# Altium schematic sheet Connectors.SchDoc
size A
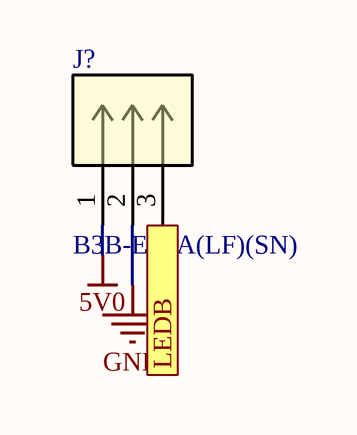
[diagram p0: Connectors.SchDoc]

## Parts
J?  B3B-EH-A(LF)(SN)  [CONN3_B3B-EH-A(LF)(SN)_JST]

## Ports
LEDB (in)

## Nets
5V0: J?.1
GND: J?.2
LEDB: J?.3 ; port LEDB

## Library data of the parts
J? = B3B-EH-A(LF)(SN): No Description Available; Vendor: JST; Built_By: EMA_Kyle; SourceLibrary: JST_2020-07-31; Datasheet: http://www.jst-mfg.com/product/pdf/eng/eEH.pdf; Manufacturer_Part_Number: B3B-EH-A(LF)(SN); Copyright: Copyright (C) 2018 Accelerated Designs. All rights reserved; RefDes: RefDes; Type: DEV